# Altium schematic sheet Power_Board.SchDoc: MAIN POWER 5V / 3V3 / 1V8
size A2; Date: Not used; ApprovedBy: Not used; CheckedBy: Not used; Author: Not used; CompanyName: STMicroelectronics; DrawnBy: Not used; Engineer: Not used; Organization: Not used; Address1: Not used; Address2: Not used; Address3: Not used; Address4: Not used; DocumentNumber: 9; Revision: Not used; SheetNumber: 5; SheetTotal: 10; CurrentTime: Not used; CurrentDate: Not used; Time: Not used; DocumentFullPathAndName: Not used; DocumentName: Not used; ModifiedDate: Not used; ImagePath: Not used; ProjectName: Not used; Application_BuildNumber: Not used
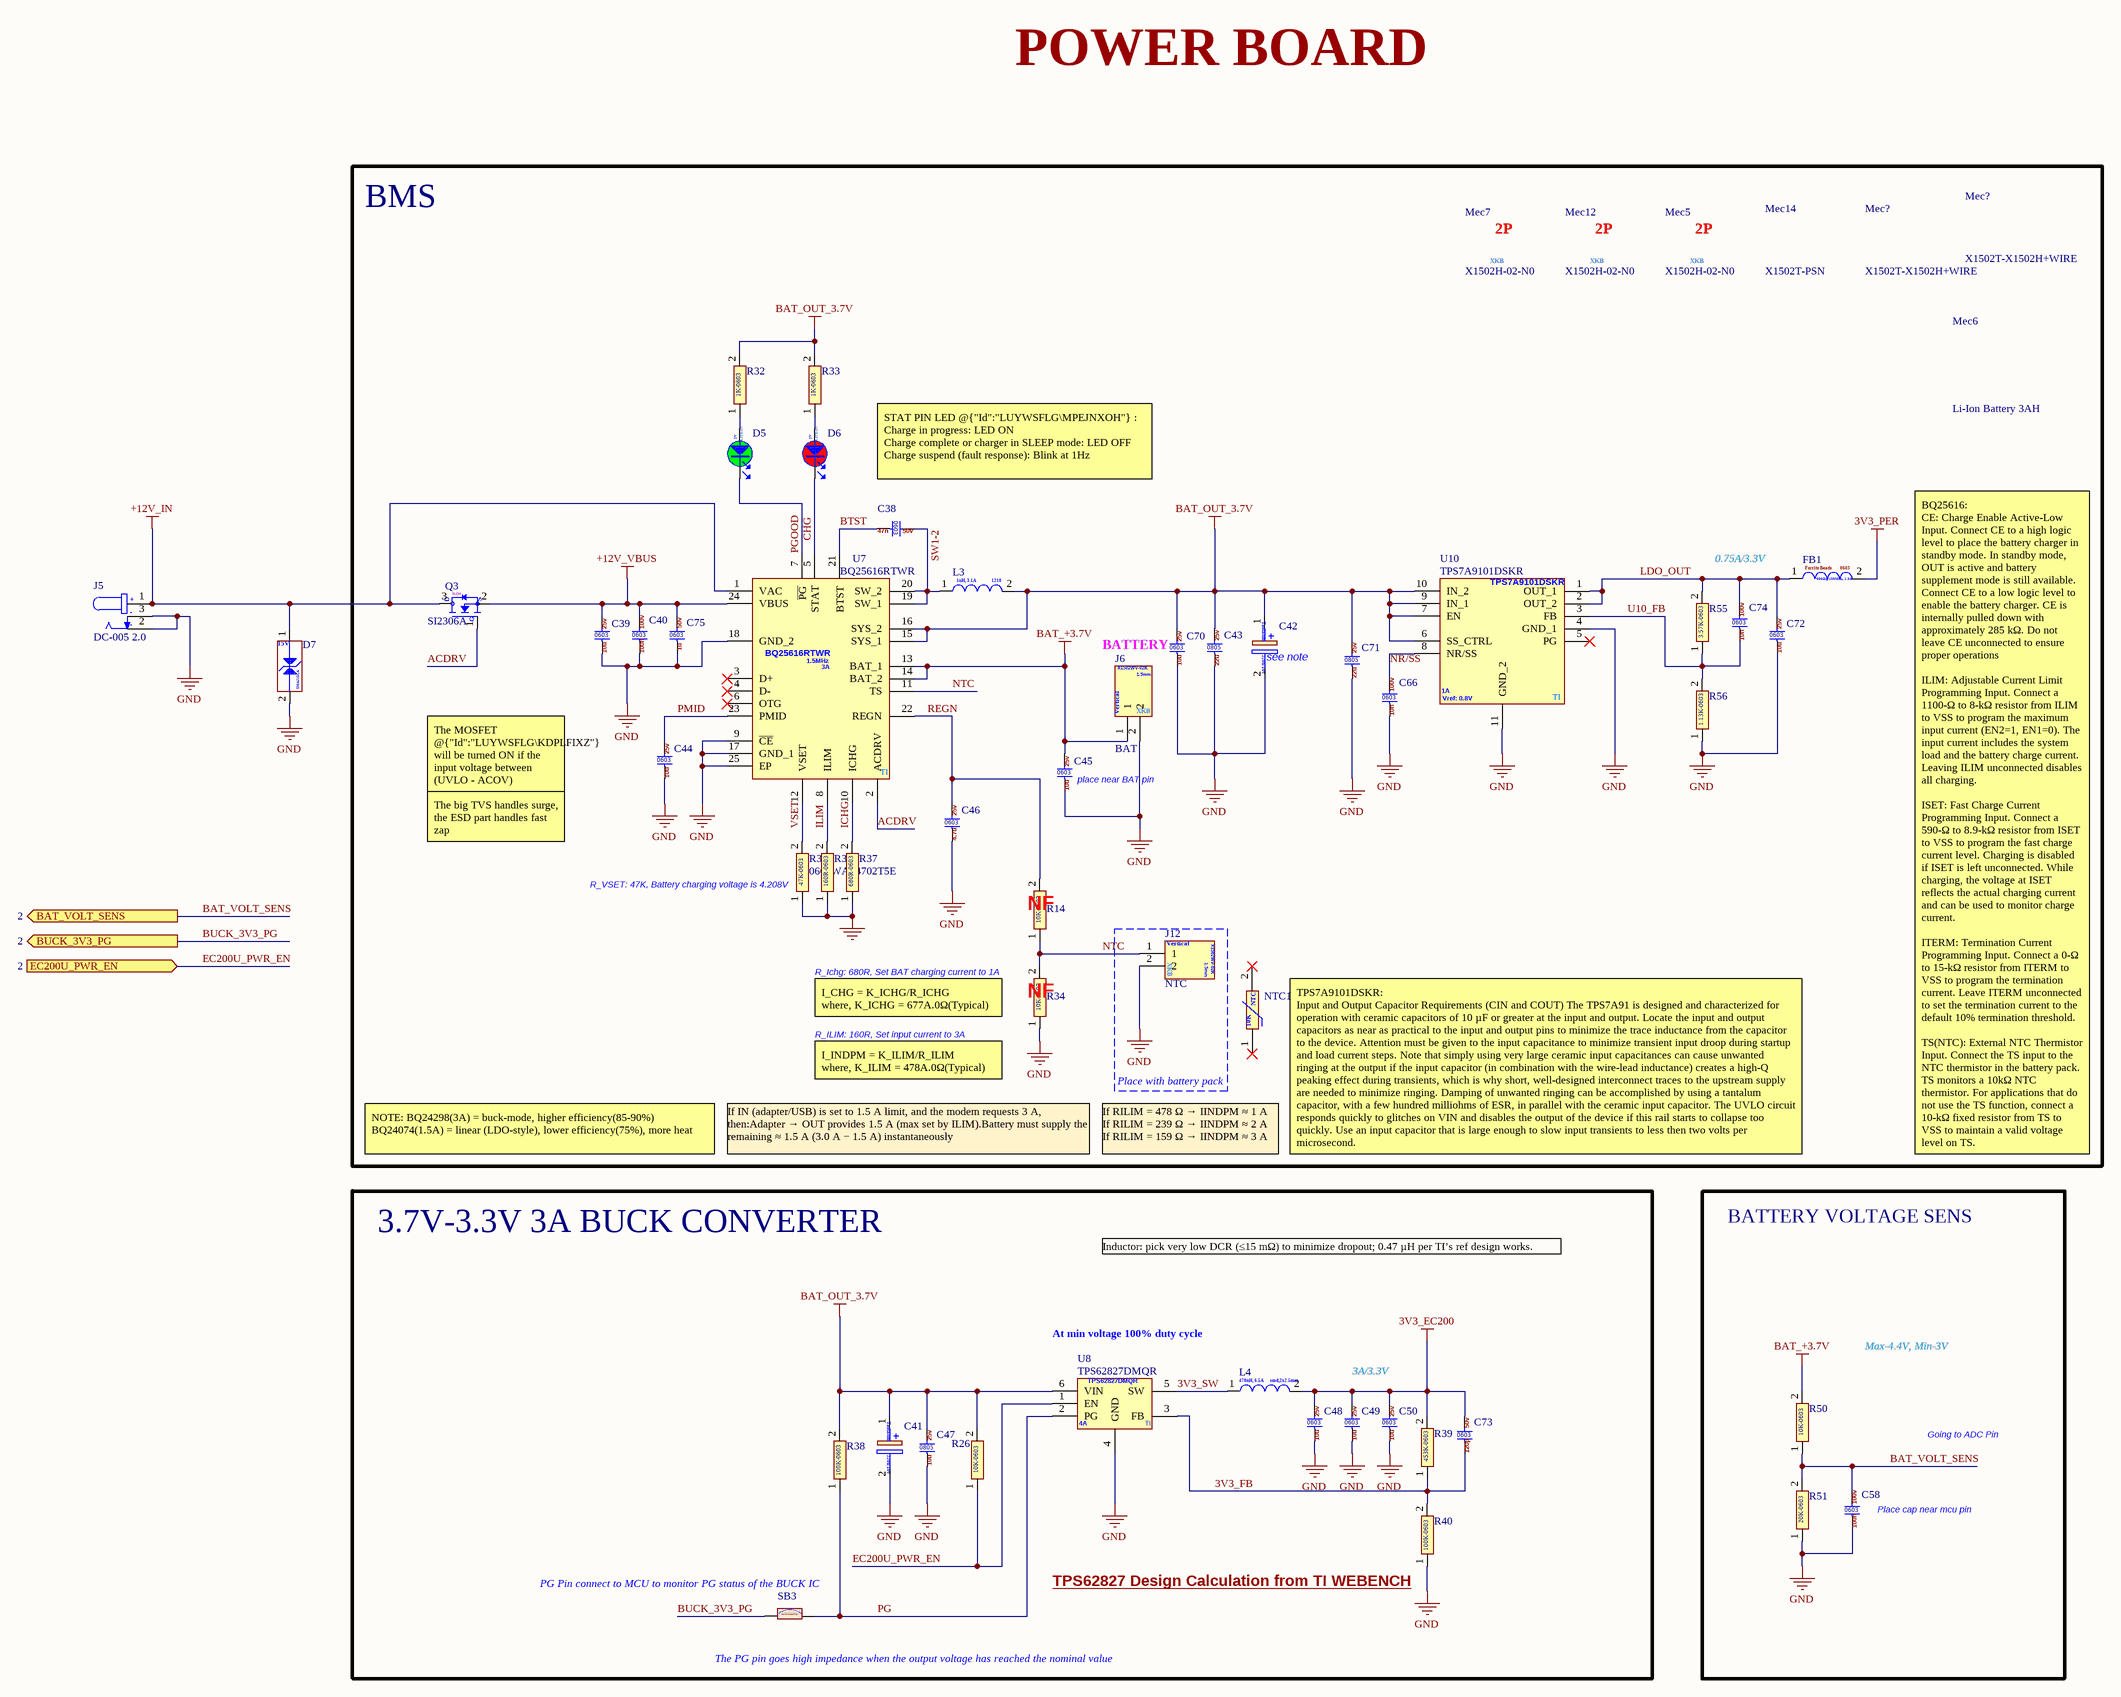
[diagram p0: Power_Board.SchDoc]

## Parts
(Parts that share a designator on the sheet are numbered #1, #2 ... from top to bottom, then left to right.)
C38  CL10B473KB8NNNC  [0603-CAP]  (value not drawn)
C39  CL10A106MA8NRNC  [0603-CAP]  (value not drawn)
C40  CL10B104KC8NNNC  [0603-CAP]  (value not drawn)
C41  TAJD227K010RNJ  [CASE-D-7343]  (value not drawn)
C42  TAJD227K010RNJ  [CASE-D-7343]  (value not drawn)
C43  CL21A226MAQNNNE  [0805-CAP]  (value not drawn)
C44  CL10A106MA8NRNC  [0603-CAP]  (value not drawn)
C45  CL10A106MA8NRNC  [0603-CAP]  (value not drawn)
C46  CL10A475KA8NQNC  [0603-CAP]  (value not drawn)
C47  CL21A106KAYNNNE  [0805-CAP]  (value not drawn)
C48  CL10A106MA8NRNC  [0603-CAP]  (value not drawn)
C49  CL10A106MA8NRNC  [0603-CAP]  (value not drawn)
C50  CL10A106MA8NRNC  [0603-CAP]  (value not drawn)
C58  CL10B104KC8NNNC  [0603-CAP]  (value not drawn)
C66  CL10B103KC8WPNC  [0603-CAP]  (value not drawn)
C70  CL10A106MA8NRNC  [0603-CAP]  (value not drawn)
C71  CL21A226MAQNNNE  [0805-CAP]  (value not drawn)
C72  CL10A106MA8NRNC  [0603-CAP]  (value not drawn)
C73  CL10C121JB81PNC  [0603-CAP]  (value not drawn)
C74  CL10B103KC8WPNC  [0603-CAP]  (value not drawn)
C75  CL10A105KB8NNNC  [0603-CAP]  (value not drawn)
D5  LTST-C170KGKT  [0805-LED-BLUE]  (value not drawn)
D6  LTST-C170KRKT  [0805-LED-RED]  (value not drawn)
D7  SMAJ15CA  [SMA (DO-214AC)]  (value not drawn)
FB1  BLM18KG601SN1D  [Ferrite Beads 0603]  (value not drawn)
J5  DC-005 2.0  [DC JACK]
J6  BAT  [JST 2P 1.5MM VERTICAL]
J12  NTC  [JST 2P 1.5MM VERTICAL]
L3  1277AS-H-1R0M=P2  [IND-1210]  (value not drawn)
L4  FTC252012SR47MBCA  [IND SMD,2x2.5mm]  (value not drawn)
Mec5  X1502H-02-N0  (mechanical)
Mec6  Li-Ion Battery 3AH  (mechanical)
Mec7  X1502H-02-N0  (mechanical)
Mec12  X1502H-02-N0  (mechanical)
Mec14  X1502T-PSN  (mechanical)
Mec?#1  X1502T-X1502H+WIRE  (mechanical)
Mec?#2  X1502T-X1502H+WIRE  (mechanical)
NTC1  NXRT15XH103FA1B030  [NXRT15XH103FA1B030]  (value not drawn)  (mechanical)
Q3  SI2306A  [SOT-23-3]
R14  0603WAF1002T5E  [0603-RES]  (value not drawn)
R26  0603WAF1002T5E  [0603-RES]  (value not drawn)
R32  0603WAF1001T5E  [0603-RES]  (value not drawn)
R33  0603WAF1001T5E  [0603-RES]  (value not drawn)
R34  0603WAF1002T5E  [0603-RES]  (value not drawn)
R35  0603WAF4702T5E  [0603-RES]
R36  0603WAF1600T5E  [0603-RES]  (value not drawn)
R37  0603WAF6800T5E  [0603-RES]  (value not drawn)
R38  0603WAF1003T5E  [0603-RES]  (value not drawn)
R39  0603WAF4533T5E  [0603-RES]  (value not drawn)
R40  0603WAF1003T5E  [0603-RES]  (value not drawn)
R50  0603WAF1002T5E  [0603-RES]  (value not drawn)
R51  0603WAF2002T5E  [0603-RES]  (value not drawn)
R55  0603WAF3571T5E  [0603-RES]  (value not drawn)
R56  0603WAF1131T5E  [0603-RES]  (value not drawn)
SB3  0603WAF0000T5E  [SOLDER-BRIDGE_R0603-0R]  (value not drawn)
U7  BQ25616RTWR  [QFN-24-EP(4x4)]
U8  TPS62827DMQR  [VSON-6(1.5x1.5) - TPS62826DMQR]
U10  TPS7A9101DSKR  [SON-10-EP(2.5x2.5)]

## Blocks framed on the sheet
BMS: C38-C40 C42-C46 C66 C70-C72 C74 C75 D5 D6 FB1 J6 L3 Mec5-Mec7 Mec12 Mec14 Mec?#1 Mec?#2 NTC1 Q3 R14 R32-R37 R55 R56 U7 U10
Place with battery pack: J12
3.7V-3.3V 3A BUCK CONVERTER: C41 C47-C50 C73 L4 R26 R38-R40 SB3 U8
BATTERY VOLTAGE SENS: C58 R50 R51

## Ports
BAT_VOLT_SENS (out, see 2), BUCK_3V3_PG (out, see 2), EC200U_PWR_EN (in, see 2)

## Nets
3V3_EC200: C48.2 C49.2 C50.2 C73.2 L4.2 R39.2
3V3_PER: FB1.2
+12V_IN: D7.1(IO1) J5.1 Q3.3(D) U7.1(VAC)
+12V_VBUS: C39.2 C40.2 C75.2 Q3.2(S) U7.24(VBUS)
BAT_+3.7V: C45.2 J6.1 R50.2 U7.13(BAT_1) U7.14(BAT_2)
BAT_OUT_3.7V: C41.1(+) C42.1(+) C43.2 C47.2 C70.2 C71.2 L3.2 R26.2 R32.2 R33.2 R38.2 U7.15(SYS_1) U7.16(SYS_2) U8.6(VIN) U10.6(SS_CTRL) U10.7(EN) U10.9(IN_1) U10.10(IN_2)
GND: C39.1 C40.1 C41.2(-) C42.2(-) C43.1 C44.1 C45.1 C46.1 C47.1 C48.1 C49.1 C50.1 C58.1 C66.1 C70.1 C71.1 C72.1 C75.1 D7.2(GND) J5.2 J5.3 J6.2 J12.2 R34.1 R35.1 R36.1 R37.1 R40.1 R51.1 R56.1 U7.9(~{CE}) U7.17(GND_1) U7.18(GND_2) U7.25(EP) U8.4(GND) U10.4(GND_1) U10.11(GND_2)
3V3_FB: C73.1 R39.1 R40.2 U8.3(FB)
3V3_SW: L4.1 U8.5(SW)
ACDRV: Q3.1(G) U7.2(ACDRV)
BAT_VOLT_SENS: C58.2 R50.1 R51.2 ; port BAT_VOLT_SENS
BTST: C38.1 U7.21(BTST)
BUCK_3V3_PG: SB3.1 ; port BUCK_3V3_PG
CHG: D6.2 U7.5(STAT)
EC200U_PWR_EN: R26.1 U8.1(EN) ; port EC200U_PWR_EN
ICHG: R37.2 U7.10(ICHG)
ILIM: R36.2 U7.8(ILIM)
LDO_OUT: C72.2 C74.2 FB1.1 R55.2 U10.1(OUT_1) U10.2(OUT_2)
NR/SS: C66.2 U10.8(NR/SS)
NTC: J12.1 R14.1 R34.2 U7.11(TS)
PG: R38.1 SB3.2 U8.2(PG)
PGOOD: D5.2 U7.7(~{PG})
PMID: C44.2 U7.23(PMID)
REGN: C46.2 R14.2 U7.22(REGN)
SW1-2: C38.2 L3.1 U7.19(SW_1) U7.20(SW_2)
U10_FB: C74.1 R55.1 R56.2 U10.3(FB)
VSET: R35.2 U7.12(VSET)
NetD5_1: D5.1 R32.1
NetD6_1: D6.1 R33.1

Not connected (* = marked no-connect by the designer): NTC1 1* 2*; U7 3(D+)* 4(D-)* 6(OTG)*; U10 5(PG)*

## Notes on the sheet
- POWER BOARD
- STAT PIN LED @{"Id":"LUYWSFLG\MPEJNXOH"} :
  Charge in progress: LED ON
  Charge complete or charger in SLEEP mode: LED OFF
  Charge suspend (fault response): Blink at 1Hz
- 0.75A/3.3V
- (near C70) BATTERY
- (near C42) see note
- The MOSFET @{"Id":"LUYWSFLG\KDPLFIXZ"} will be turned ON if the input voltage between (UVLO - ACOV)
  ACOV: 14.2-V
- (near C45) place near BAT pin
- The big TVS handles surge, the ESD part handles fast zap
- (near R35) R_VSET: 47K, Battery charging voltage is 4.208V
- (near R14) NF
- (near R34) R_Ichg: 680R, Set BAT charging current to 1A
- (near R34) NF
- R_ILIM: 160R, Set input current to 3A
- (near R34) I_CHG = K_ICHG/R_ICHG
  where, K_ICHG = 677A.0Ω(Typical)
- (near R34) I_INDPM = K_ILIM/R_ILIM
  where, K_ILIM = 478A.0Ω(Typical)
- NOTE: BQ24298(3A) = buck-mode, higher efficiency(85-90%)
  BQ24074(1.5A) = linear (LDO-style), lower efficiency(75%), more heat
- If IN (adapter/USB) is set to 1.5 A limit, and the modem requests 3 A, then:Adapter → OUT provides 1.5 A (max set by ILIM).Battery must supply the remaining ≈ 1.5 A (3.0 A − 1.5 A) instantaneously
- If RILIM = 478 Ω → IINDPM ≈ 1 A
  If RILIM = 239 Ω → IINDPM ≈ 2 A
  If RILIM = 159 Ω → IINDPM ≈ 3 A
- (near NTC1) TPS7A9101DSKR:
  Input and Output Capacitor Requirements (CIN and COUT) The TPS7A91 is designed and characterized for operation with ceramic capacitors of 10 µF or greater at the input and output. Locate the input and output capacitors as near as practical to the input and output pins to minimize the trace inductance from the capacitor to the device. Attention must be given to the input capacitance to minimize transient input droop during startup and load current steps. Note that simply using very large ceramic input capacitances can cause unwanted ringing at the output if the input capacitor (in combination with the wire-lead inductance) creates a high-Q peaking effect during transients, which is why short, well-designed interconnect traces to the upstream supply are needed to minimize ringing. Damping of unwanted ringing can be accomplished by using a tantalum capacitor, with a few hundred milliohms of ESR, in parallel with the ceramic input capacitor. The UVLO circuit responds quickly to glitches on VIN and disables the output of the device if this rail starts to collapse too quickly. Use an input capacitor that is large enough to slow input transients to less then two volts per microsecond.
- BQ25616:
  CE: Charge Enable Active-Low Input. Connect CE to a high logic level to place the battery charger in standby mode. In standby mode, OUT is active and battery supplement mode is still available. Connect CE to a low logic level to enable the battery charger. CE is internally pulled down with approximately 285 kΩ. Do not leave CE unconnected to ensure proper operations
  ILIM: Adjustable Current Limit Programming Input. Connect a 1100-Ω to 8-kΩ resistor from ILIM to VSS to program the maximum input current (EN2=1, EN1=0). The input current includes the system load and the battery charge current. Leaving ILIM unconnected disables all charging.
  ISET: Fast Charge Current Programming Input. Connect a 590-Ω to 8.9-kΩ resistor from ISET to VSS to program the fast charge current level. Charging is disabled if ISET is left unconnected. While charging, the voltage at ISET reflects the actual charging current and can be used to monitor charge current.
  ITERM: Termination Current Programming Input. Connect a 0-Ω to 15-kΩ resistor from ITERM to VSS to program the termination current. Leave ITERM unconnected to set the termination current to the default 10% termination threshold.
  TS(NTC): External NTC Thermistor Input. Connect the TS input to the NTC thermistor in the battery pack. TS monitors a 10kΩ NTC thermistor. For applications that do not use the TS function, connect a 10-kΩ fixed resistor from TS to VSS to maintain a valid voltage level on TS.
- Inductor: pick very low DCR (≤15 mΩ) to minimize dropout; 0.47 µH per TI’s ref design works.
- At min voltage 100% duty cycle
- 3A/3.3V
- Max-4.4V, Min-3V
- Going to ADC Pin
- (near C58) Place cap near mcu pin
- (near SB3) PG Pin connect to MCU to monitor PG status of the BUCK IC
- (near R40) TPS62827 Design Calculation from TI WEBENCH <https://webench.ti.com/power-designer/switching-regulator/customize/15>
- (near SB3) The PG pin goes high impedance when the output voltage has reached the nominal value
- Title:
- Project:
- Size:
- Revision:
- Variant:
- A4
- -
- Date:
- Reference:
- Sheet:
- of
- (in symbol 0603WAF1001T5E) 1K-0603
- (in symbol 0603WAF1002T5E) 10K-0603
- (in symbol 0603WAF1003T5E) 100K-0603
- (in symbol 0603WAF1131T5E) 1.13K-0603
- (in symbol 0603WAF1600T5E) 160R-0603
- (in symbol 0603WAF2002T5E) 20K-0603
- (in symbol 0603WAF3571T5E) 3.57K-0603
- (in symbol 0603WAF4533T5E) 453K-0603
- (in symbol 0603WAF4702T5E) 47K-0603
- (in symbol 0603WAF6800T5E) 680R-0603
- (in symbol 1277AS-H-1R0M=P2) 1uH, 3.1A; 1210
- (in symbol BLM18KG601SN1D) Ferrite Beads; 0603; 600Ω@100MHz, 1.3A
- (in symbol BQ25616RTWR) 1.5MHz; 3A; TI
- (in symbol CL10A105KB8NNNC) 50v; 0603; 1u
- (in symbol CL10A106MA8NRNC) 25v; 0603; 10u
- (in symbol CL10A475KA8NQNC) 25v; 0603; 4.7u
- (in symbol CL10B103KC8WPNC) 100v; 0603; 10n
- (in symbol CL10B104KC8NNNC) 100v; 0603; 100n
- (in symbol CL10B473KB8NNNC) 0603; 47n; 50v
- (in symbol CL10C121JB81PNC) 50v; 0603; 120p
- (in symbol CL21A106KAYNNNE) 25v; 0805; 10u
- (in symbol CL21A226MAQNNNE) 25v; 0805; 22u
- (in symbol DC-005 2.0) +; -
- (in symbol FTC252012SR47MBCA) 470nH, 6.5A; smd,2x2.5mm
- (in symbol LTST-C170KGKT) 2V; LITEON
- (in symbol LTST-C170KRKT) 2V; LITEON
- (in symbol NXRT15XH103FA1B030) NTC; 10K
- (in symbol SI2306A) N-CH
- (in symbol SMAJ15CA) 15V
- (in symbol TAJD227K010RNJ) Tantalum; 220u/10v
- (in symbol TPS7A9101DSKR) 1A; Vref: 0.8V; TI
- (in symbol TPS62827DMQR) 4A; TI
- (in symbol X1502H-02-N0) 2P; XKB
- (in symbol X1502WV-02K-N0SN) X1502WV-02K; 1.5mm; Vertical; XKB

## Library data of the parts
C38 = CL10B473KB8NNNC: CAP: CER 47NF 50V X7R 0603; POC Price: 0.0051; LCSC Part #: C1622; Unit Price: 0.0031; ComponentLink1Description: DS; ComponentLink1URL: https://www.lcsc.com/datasheet/C1588.pdf
C39 C44 C45 C48-C50 C70 C72 = CL10A106MA8NRNC: CAP: CER 10UF 25V X5R 0603; LCSC Part #: C96446; Unit Price: 0.01; ComponentLink1Description: DS; ComponentLink1URL: https://www.lcsc.com/datasheet/C96446.pdf
C40 C58 = CL10B104KC8NNNC: CAP: CER 100NF 100V X7R 0603; POC Price: 0.006; LCSC Part #: C15725; Unit Price: 0.0036; ComponentLink1Description: DS; ComponentLink1URL: https://www.lcsc.com/datasheet/C15725.pdf
C41 C42 = TAJD227K010RNJ: CAP: TANT 220uF ±10% 10V CASE-D-7343; POC Price: 0.3941; LCSC Part #: C8024; Unit Price: 0.2118
C43 C71 = CL21A226MAQNNNE: CAP: CER 22UF 25V X5R 0805; LCSC Part #: C45783; Unit Price: 0.0136
C46 = CL10A475KA8NQNC: CAP: CER 4.7UF 25V X5R 0603; POC Price: 0.0167; LCSC Part #: C69335; Unit Price: 0.009; ComponentLink1Description: DS; ComponentLink1URL: https://www.lcsc.com/datasheet/C69335.pdf
C47 = CL21A106KAYNNNE: CAP: CER 10UF 25V X5R 0805; LCSC Part #: C15850; Unit Price: 0.0059
C66 C74 = CL10B103KC8WPNC: CAP: CER 10NF 100V X7R 0603; LCSC Part #: C307347; Unit Price: 0.0046
C73 = CL10C121JB81PNC: CAP: CER 120PF 50V C0G 0603; POC Price: 0.011; LCSC Part #: C444883; Unit Price: 0.0048
C75 = CL10A105KB8NNNC: CAP: CER 1UF 50V X5R 0603; LCSC Part #: C15849; Unit Price: 0.0026
D5 = LTST-C170KGKT: LED: GREEN 20mA 35mcd Water Clear -55℃~+85℃ 571nm Yellow Green 130° 75mW 2V 0805 LED Indication - Discrete ROHS; POC Price: 0.0216; LCSC Part #: C98221; Unit Price: 0.0095; ComponentLink1Description: DS; ComponentLink1URL: https://www.lcsc.com/datasheet/C98221.pdf
D6 = LTST-C170KRKT: LED: RED 20mA 54mcd Colorless Transparent Lens -55℃~+85℃ 631nm Red 130° 75mW 2V 0805 LED; POC Price: 0.0229; LCSC Part #: C94868; Unit Price: 0.0107
D7 = SMAJ15CA: DIODE ESD: 16.4A@10/1000us 400W@10/1000us 24.4V 18.5V Bidirectional 15V DO-214AC(SMA) ESD and Surge Protection (TVS/ESD) ROHS; POC Price: 0.0378; LCSC Part #: C110044; Unit Price: 0.0178; ComponentLink1Description: DS; ComponentLink1URL: https://www.lcsc.com/datasheet/C110044.pdf
FB1 = BLM18KG601SN1D: Ferrite Beads: 150mΩ 600Ω@100MHz 1.3A muRata; POC Price: 0.0113; LCSC Part #: C85833; Unit Price: 0.0059; ComponentLink1Description: DS; ComponentLink1URL: https://www.lcsc.com/datasheet/C85833.pdf
J5 = DC-005 2.0: CONN: Right Angle DC Power Jack -25℃~+85℃ 2mm 6.4mm 1A 12V Through Hole DC Power Connectors ROHS; LCSC Part #: C16214
J6 J12 = X1502WV-02K-N0SN: JST: Vertical, P1.5mm TH, 2P, Wire To Board Connector, 1A (Housing: X1502H-02-N0 - C697053); POC Price: 0.0156; LCSC Part #: C561525; Unit Price: 0.0071; ComponentLink1Description: DS; ComponentLink1URL: https://www.lcsc.com/datasheet/C561525.pdf
L3 = 1277AS-H-1R0M=P2: INDUCTOR: 1uH 3.1A 45mΩ 1210 FIXED IND; POC Price: 0.1051; LCSC Part #: C237284; ComponentLink1Description: DS; ComponentLink1URL: https://www.lcsc.com/datasheet/C237284.pdf; Unit Price: 0.0566
L4 = FTC252012SR47MBCA: INDUCTOR: FIXED IND 0.47uH 6.5A 13mΩ SMD,2x2.5mm; POC Price: 0.0806; LCSC Part #: C5832368; Unit Price: 0.0393; ComponentLink1Description: DS; ComponentLink1URL: https://www.lcsc.com/datasheet/C167222.pdf
Mec5 Mec7 Mec12 = X1502H-02-N0: JST Housing: P1.5mm, 2P, Wire To Board; POC Price: 0.0042; LCSC Part #: C697053; Unit Price: 0.0036; ComponentLink1Description: DS; ComponentLink1URL: https://www.lcsc.com/datasheet/C697053.pdf
Mec6 = Li-Ion Battery 3AH: Battery: Li ion, Li-ion 3ah; Parameter 1: *
Mec14 = X1502T-PSN: Con: Rectangular Connector Contacts ROHS; JST; HOUSING; P1.5mm; 2P; 3P; 4P; WIRE TO BOARD; X1502H; X1503H; X1504H; X1505H; X1506H; X1502T; X1503T; X1504T; X1505T; X1506T; POC Price: 0.005; LCSC Part #: C780064; Unit Price: 0.0024; ComponentLink1Description: DS; ComponentLink1URL: https://www.lcsc.com/datasheet/C780064.pdf
Mec?#1 Mec?#2 = X1502T-PSN-A28RB-L100-T3: Hook-Up Wire: Housing+contact; Single Conductor Cables (Hook-Up Wire); JST; HOUSING; P1.5mm; 2P; WIRE TO BOARD; X1502H; X1502T; 28 AWG; POC Price: 0.0789; LCSC Part #: C6118644; Unit Price: 0.0727; ComponentLink1Description: DS
NTC1 = NXRT15XH103FA1B030: NTC: 10kΩ 7.5mW 3380K ±1% Through Hole,P=2.5mm NTC Thermistors ROHS; POC Price: 0.3195; ComponentLink1Description: DS; ComponentLink1URL: https://componentsearchengine.com/Datasheets/1/NXRT15XH103FA1B030.pdf; LCSC Part #: C152559; Unit Price: 0.1511
Q3 = SI2306A: MOSFET: N-CH 30V 4A 1.25W 35mΩ@10V 3V@250uA 1 N-Channel SOT-23 MOSFETs ROHS; LCSC Part #: C347489; Unit Price: 0.0155
R14 R26 R34 R50 = 0603WAF1002T5E: RES: 10K OHM 1% 100mW 0603 75V; LCSC Part #: C25804; Unit Price: 0.0005; ComponentLink1Description: DS; ComponentLink1URL: https://www.lcsc.com/datasheet/C25804.pdf
R32 R33 = 0603WAF1001T5E: RES: 1K OHM 1% 100mW 0603 75V; LCSC Part #: C21190; Unit Price: 0.0005; ComponentLink1Description: DS; ComponentLink1URL: https://www.lcsc.com/datasheet/C21190.pdf
R35 = 0603WAF4702T5E: RES: 47K OHM 1% 100mW 0603 75V; LCSC Part #: C25819; Unit Price: 0.0006; ComponentLink1Description: DS; ComponentLink1URL: https://www.lcsc.com/datasheet/C25819.pdf
R36 = 0603WAF1600T5E: RES: 160R OHM 1% 100mW 0603 75V; POC Price: 0.0011; LCSC Part #: C22814; Unit Price: 0.0006; ComponentLink1Description: DS; ComponentLink1URL: https://www.lcsc.com/datasheet/C22787.pdf
R37 = 0603WAF6800T5E: RES: 680R OHM 1% 100mW 0603 75V; POC Price: 0.0011; LCSC Part #: C23228; Unit Price: 0.0006; ComponentLink1Description: DS; ComponentLink1URL: https://www.lcsc.com/datasheet/C22787.pdf
R38 R40 = 0603WAF1003T5E: RES: 100K OHM 1% 100mW 0603 75V; LCSC Part #: C25803; Unit Price: 0.0006; ComponentLink1Description: DS; ComponentLink1URL: https://www.lcsc.com/datasheet/C25803.pdf
R39 = 0603WAF4533T5E: RES: 453K OHM 1% 100mW 0603 75V; POC Price: 0.001; LCSC Part #: C25818; Unit Price: 0.0005; ComponentLink1Description: DS; ComponentLink1URL: https://www.lcsc.com/datasheet/C25818.pdf
R51 = 0603WAF2002T5E: RES: 20K OHM 1% 100mW 0603 75V; LCSC Part #: C4184; Unit Price: 0.0006; ComponentLink1Description: DS; ComponentLink1URL: https://www.lcsc.com/datasheet/C4184.pdf
R55 = 0603WAF3571T5E: RES: 3.57K OHM 1% 100mW 0603 75V; POC Price: 0.001; LCSC Part #: C22998; Unit Price: 0.0005; ComponentLink1Description: DS; ComponentLink1URL: https://www.lcsc.com/datasheet/C22998.pdf
R56 = 0603WAF1131T5E: RES: 1.13K OHM 1% 100mW 0603 75V; POC Price: 0.0011; LCSC Part #: C22833; Unit Price: 0.0006; ComponentLink1Description: DS; ComponentLink1URL: https://www.lcsc.com/datasheet/C22833.pdf
SB3 = 0603WAF0000T5E: Solder Bridge: ON SB 0603; LCSC Part #: C21189; Unit Price: 0.0006; ComponentLink1Description: DS; ComponentLink1URL: https://www.lcsc.com/datasheet/C21189.pdf
U7 = BQ25616RTWR: BMS: 4V~13.5V Lithium Battery 1 3A QFN-24-EP(4x4) Battery Management ROHS; POC Price: 0.6499; ComponentLink1Description: DS; ComponentLink1URL: https://www.lcsc.com/datasheet/C2866447.pdf; LCSC Part #: C2866447; Unit Price: 0.3173
U8 = TPS62827DMQR: SMPS BUCK: 2.4V to 5.5V input, 4A step-down converter; POC Price: 0.5713; ComponentLink1Description: DS; ComponentLink1URL: https://www.ti.com/lit/gpn/tps62827; LCSC Part #: C2071448; Unit Price: 0.5436
U10 = TPS7A9101DSKR: LDO: 39dB@(500kHz) 1A Adjustable 800mV~5.2V Positive 6.5V SON-10-EP(2.5x2.5) Voltage Regulators - Linear, Low Drop Out (LDO) Regulators ROHS; POC Price: 0.5248; ComponentLink1Description: DS; ComponentLink1URL: http://www.ti.com/lit/ds/symlink/tps7a91.pdf; LCSC Part #: C2878140; Unit Price: 0.2563